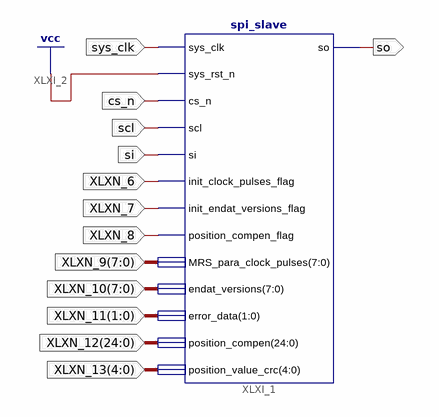
[diagram p0: schematic sheet 1]
// Xilinx ISE schematic spi_top.sch (spartan3a) as structural Verilog: 1 symbols, 13 ports
module spi_top (
  input  sys_clk,
  input  cs_n,
  input  scl,
  input  si,
  input  XLXN_6,
  input  XLXN_7,
  input  XLXN_8,
  input  [7:0] XLXN_9,
  input  [7:0] XLXN_10,
  input  [1:0] XLXN_11,
  input  [24:0] XLXN_12,
  input  [4:0] XLXN_13,
  output so
);

  spi_slave XLXI_1 (
    .sys_clk(sys_clk), .sys_rst_n(1'b1), .cs_n(cs_n), .scl(scl), .si(si), .init_clock_pulses_flag(XLXN_6),
    .init_endat_versions_flag(XLXN_7), .position_compen_flag(XLXN_8), .MRS_para_clock_pulses(XLXN_9),
    .endat_versions(XLXN_10), .error_data(XLXN_11), .position_compen(XLXN_12), .position_value_crc(XLXN_13),
    .so(so));
endmodule
